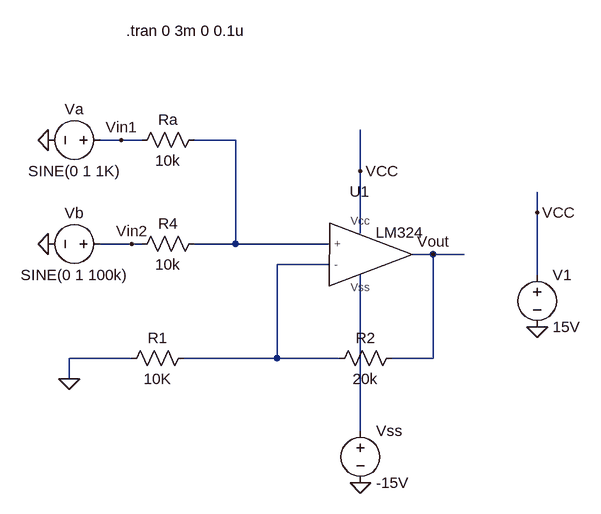
[diagram p0: schematic BAI 3 CHUAN BI 1.asc]
BAI 3 CHUAN BI 1.asc, the LTspice schematic file:
Version 4.1
SHEET 1 880 680
WIRE -176 -48 -208 -48
WIRE -144 -48 -176 -48
WIRE 0 -48 -64 -48
WIRE 192 0 192 -64
WIRE 464 64 464 32
WIRE 192 96 192 0
WIRE -160 112 -208 112
WIRE -144 112 -160 112
WIRE 0 112 0 -48
WIRE 0 112 -64 112
WIRE 144 112 0 112
WIRE 304 128 272 128
WIRE 352 128 304 128
WIRE 144 144 64 144
WIRE 464 160 464 64
WIRE -160 288 -256 288
WIRE 64 288 64 144
WIRE 64 288 -80 288
WIRE 160 288 64 288
WIRE 304 288 304 128
WIRE 304 288 240 288
WIRE -256 320 -256 288
WIRE 192 400 192 160
FLAG 304 128 Vout
FLAG -256 320 0
FLAG -288 -48 0
FLAG -288 112 0
FLAG 192 0 VCC
FLAG 464 240 0
FLAG 464 64 VCC
FLAG -176 -48 Vin1
FLAG -160 112 Vin2
FLAG 192 480 0
SYMBOL LM324 192 128 R0
WINDOW 3 61 -49 Top 2
SYMATTR InstName U1
SYMBOL res 256 272 R90
WINDOW 0 0 56 VBottom 2
WINDOW 3 32 56 VTop 2
SYMATTR InstName R2
SYMATTR Value 20k
SYMBOL res -64 272 R90
WINDOW 0 0 56 VBottom 2
WINDOW 3 32 56 VTop 2
SYMATTR InstName R1
SYMATTR Value 10K
SYMBOL res -48 -64 R90
WINDOW 0 0 56 VBottom 2
WINDOW 3 32 56 VTop 2
SYMATTR InstName Ra
SYMATTR Value 10k
SYMBOL voltage -192 -48 R90
WINDOW 0 -32 56 VBottom 2
WINDOW 3 32 56 VTop 2
WINDOW 39 0 0 Left 0
SYMATTR InstName Va
SYMATTR Value SINE(0 1 1K)
SYMATTR Value2 AC 1 0
SYMBOL res -48 96 R90
WINDOW 0 0 56 VBottom 2
WINDOW 3 32 56 VTop 2
SYMATTR InstName R4
SYMATTR Value 10k
SYMATTR SpiceLine pwr=0.
SYMBOL voltage -192 112 R90
WINDOW 0 -32 56 VBottom 2
WINDOW 3 32 56 VTop 2
WINDOW 123 60 56 VTop 2
WINDOW 39 0 0 Left 0
SYMATTR InstName Vb
SYMATTR Value SINE(0 1 100k)
SYMBOL voltage 464 144 R0
WINDOW 123 0 0 Left 0
WINDOW 39 0 0 Left 0
SYMATTR InstName V1
SYMATTR Value 15V
SYMBOL voltage 192 384 R0
SYMATTR InstName Vss
SYMATTR Value -15V
TEXT -168 -216 Left 2 !.tran 0 3m 0 0.1u

The netlist it stands for:
* BAI 3 CHUAN BI 1.asc
X§U1 N001 N002 VCC N003 Vout LM324  ; pins + - Vcc Vss ?
R2 Vout N002 20k
R1 N002 0 10K
Ra N001 Vin1 10k
Va Vin1 0 SINE(0 1 1K) AC 1 0
R4 N001 Vin2 10k pwr=0.
Vb Vin2 0 SINE(0 1 100k)
V1 VCC 0 15V
Vss N003 0 -15V
.tran 0 3m 0 0.1u
.lib E:\ThiThucHanhCoHa\CoHa\LM324.cir
.backanno
.end